# EAGLE design heater-board (EAGLE 5.04)
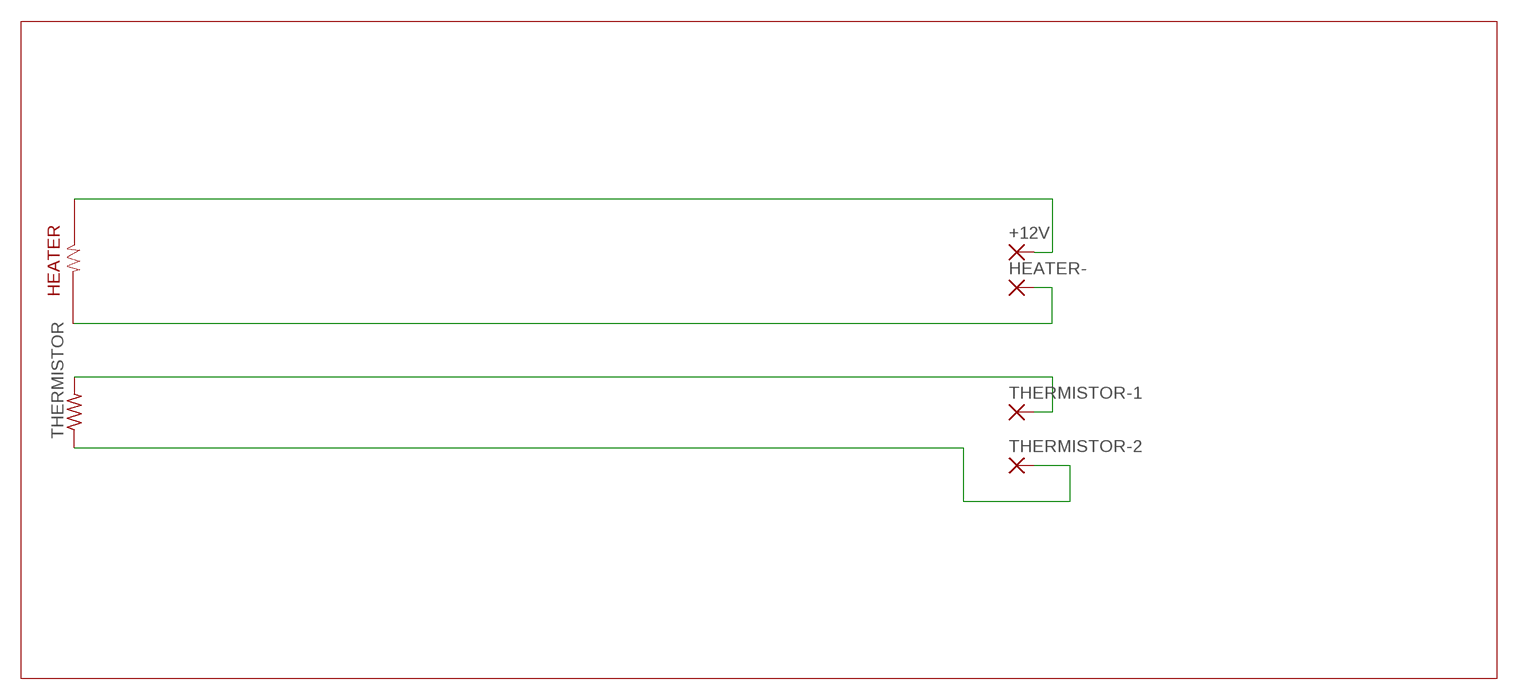
[diagram p0: schematic, sheet 1]

## Parts
+12V  WIREPADSMD5-1,8  [5-1,8]
HEATER-  WIREPADSMD5-1,8  [5-1,8]
THERMISTOR  R-US_R0805  [R0805]
THERMISTOR-1  WIREPADSMD5-1,8  [5-1,8]
THERMISTOR-2  WIREPADSMD5-1,8  [5-1,8]

## Nets
N$1: HEATER-.1(P)
N$2: THERMISTOR-1.1(P) THERMISTOR.2
N$3: THERMISTOR-2.1(P) THERMISTOR.1
N$37: +12V.1(P)

## Notes on the sheet
- HEATER

## Library data of the parts
+12V HEATER- THERMISTOR-1 THERMISTOR-2 = wirepad:WIREPAD: Wire PAD connect wire on PCB
THERMISTOR = rcl:R-US_: RESISTOR, American symbol

## Board
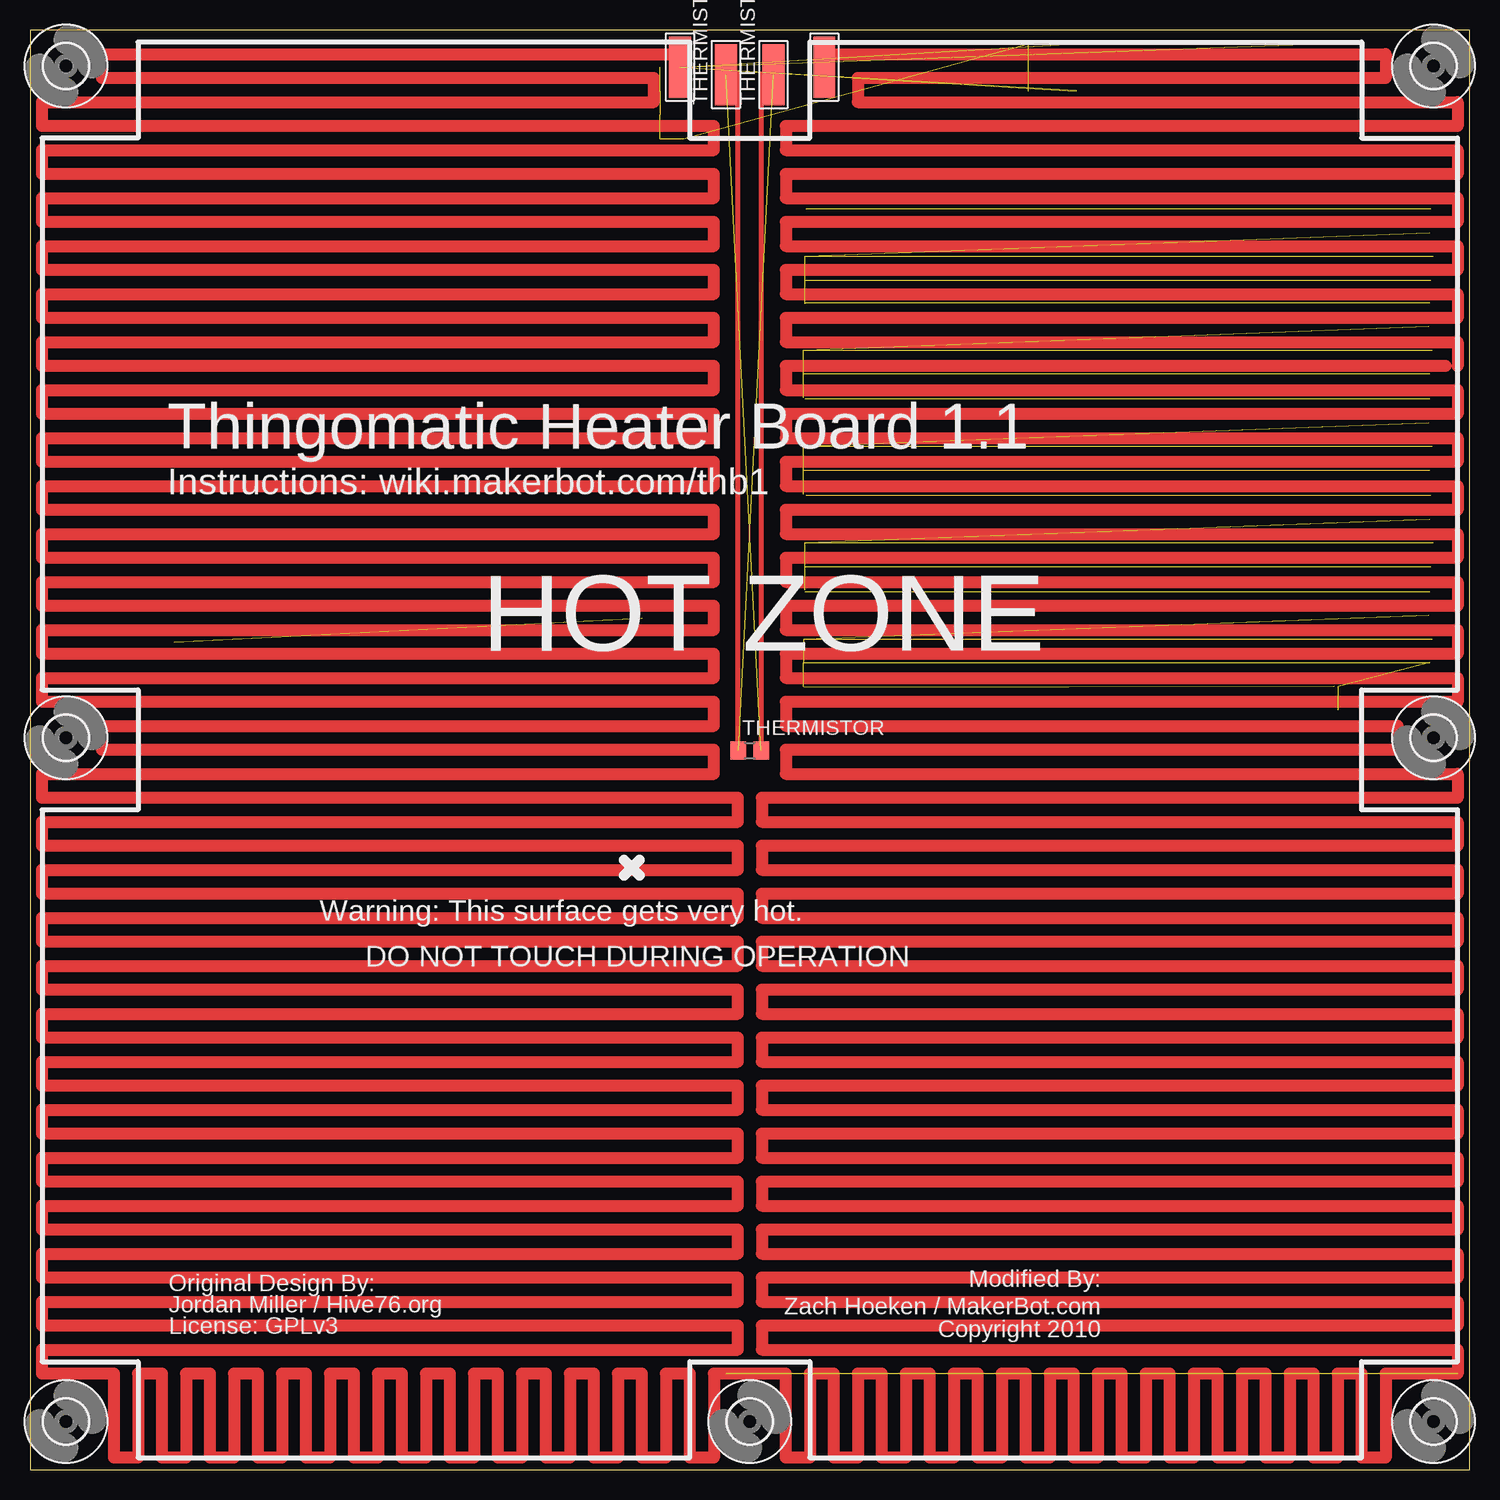
[diagram p1: board, top side]
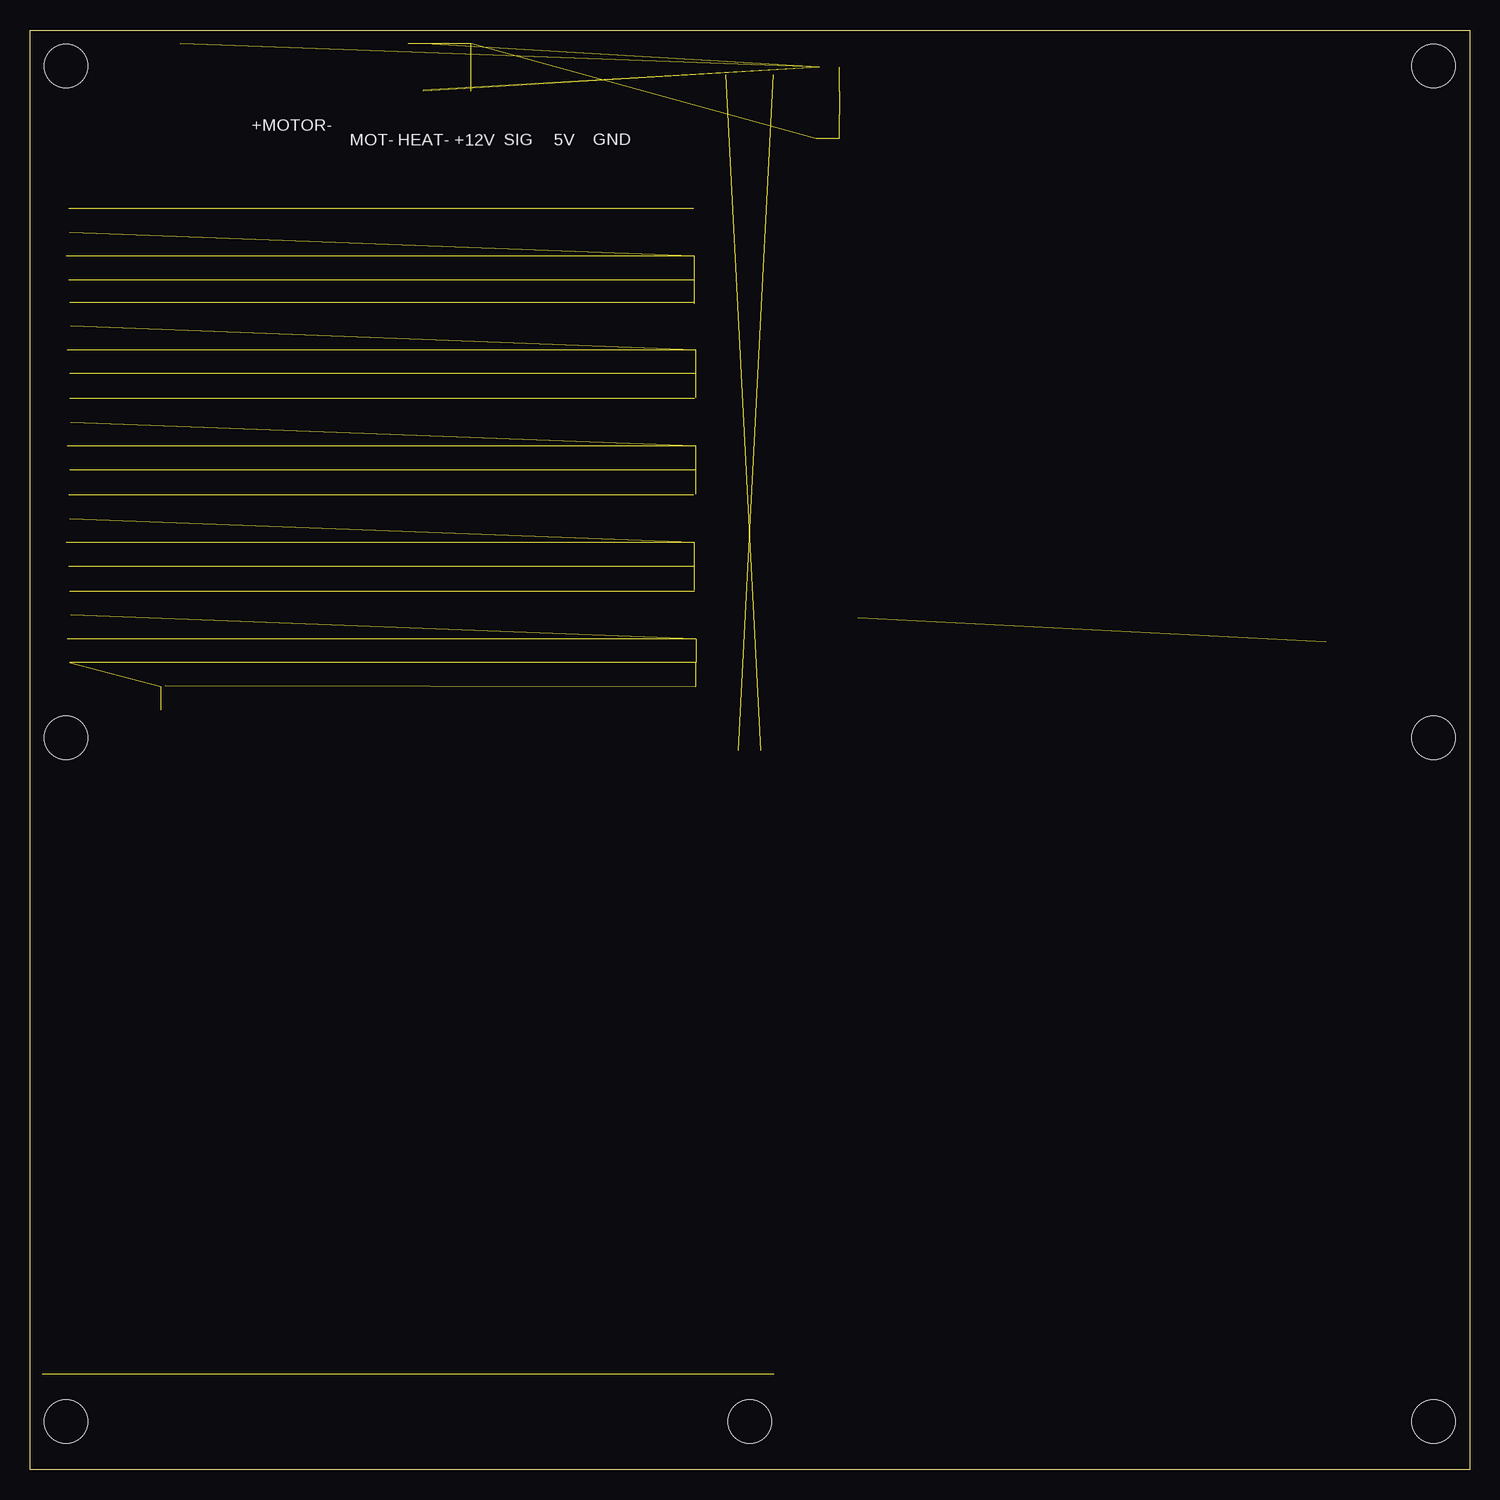
[diagram p2: board, bottom side, seen from below]

Size 120 x 120 mm. Coordinates in mm from the lower left corner, seen from the top.
Outline: 0,0 120,0 120,120 0,120 0,0
Copper layers (1*16): Top 0.035mm / dielectric 1.5mm / Bottom 0.035mm
Design rules "SparkFun *": minimum track width 10mil, minimum drill 20mil, track to track 10mil, track to pad 10mil, pad to pad 10mil, via to via 10mil, smd to smd 10mil, copper to edge 10mil, drill to drill 8mil, minimum pad ring 12mil, minimum via ring 10mil, stop-mask expansion 4mil, vias tented up to drill 25mil, thermal gap 10mil

### Footprints (pad centres in the part's own frame; a part is rotated, then mirrored left to right if it is on the bottom)
5-1,8 = smd 1.829 x 5.08: 1 0,0
R0805 = smd 1.3 x 1.5: 1 -0.95,0; 2 0.95,0
3,6 = hole 3.6: 0,0

### Placement (x,y rotation side)
+12V  66.21,116.91 180 top
HEATER-  54.17,116.91 180 top
THERMISTOR  59.99,59.94 0 top
THERMISTOR-1  58.01,116.28 0 top
THERMISTOR-2  61.98,116.28 0 top
U$2  [3,6]  3,4 0 top
U$3  [3,6]  3,61 0 top
U$4  [3,6]  3,117 0 top
U$5  [3,6]  117,117 0 top
U$6  [3,6]  117,61 0 top
U$7  [3,6]  117,4 0 top
U$8  [3,6]  60,4 0 top

### Tracks (layer width: path | path; a pad name or v marks a point on that pad's centre or on a via)
N$1  (13 unrouted)
N$2  (1 unrouted)
N$3  (1 unrouted)
N$6  (7 unrouted)
N$7  (1 unrouted)
N$10  (5 unrouted)
N$11  (1 unrouted)
N$12  (5 unrouted)
N$13  (1 unrouted)
N$14  (5 unrouted)
N$15  (1 unrouted)
N$16  (5 unrouted)
N$17  (1 unrouted)
N$18  (1 unrouted)
N$19
  Top 0.406: 60.96,59.94 60.98,59.94 60.98,116.33
N$20
  Top 0.406: 59.03,59.94 59.01,59.94 59.01,116.33
N$21  (1 unrouted)
N$22
  Top 0.991: 66,116 66,118 113,118 113,116 69,116 69,114 119,114 119,112 63,112 63,110 119,110 119,108 63,108 63,106 119,106 119,104 63,104 63,102 119,102 119,100 63,100 63,98 119,98 119,96 63,96 63,94 119,94 119,92
N$23  (1 unrouted)
  Top 0.991: 118,92 63,92 63,90 119,90 119,88 63,88 63,86 119,86 119,84 63,84 63,82 119,82 119,80 63,80 63,78 119,78 119,76 63,76 63,74 119,74 119,72 63,72 63,70 119,70 119,68 63,68 63,66 119,66 119,64 63,64 63,62 114,62 114,60 63,60 63,58 119,58 119,56 61,56 61,54 119,54 119,52 61,52 61,50 119,50 119,48 61,48 61,46 119,46 119,44 61,44 61,42 119,42 119,40 61,40 61,38 119,38 119,36 61,36 61,34 119,34 119,32 61,32 61,30 119,30 119,28 61,28 61,26 119,26 119,24 61,24 61,22 119,22 119,20 61,20 61,18 119,18 119,16 61,16 61,14 119,14 119,12 61,12 61,10 119,10 119,8 113,8 113,1 111,1 111,8 109,8 109,1 107,1 107,8 105,8 105,1 103,1 103,8 101,8 101,1 99,1 99,8 97,8 97,1 95,1 95,8 93,8 93,1 91,1 91,8 89,8 89,1 87,1 87,8 85,8 85,1 83,1 83,8 81,8 81,1 79,1 79,8 77,8 77,1 75,1 75,8 73,8 73,1 71,1 71,8 69,8 69,1 67,1 67,8 65,8 65,1 63,1 63,8 58,8 57,8 57,1 55,1 55,8 53,8 53,1 51,1 51,8 49,8 49,1 47,1 47,8 45,8 45,1 43,1 43,8 41,8 41,1 39,1 39,8 37,8 37,1 35,1 35,8 33,8 33,1 31,1 31,8 29,8 29,1 27,1 27,8 25,8 25,1 23,1 23,8 21,8 21,1 19,1 19,8 17,8 17,1 15,1 15,8 13,8 13,1 11,1 11,8 9,8 9,1 7,1 7,8 1,8 1,10 59,10 59,12 1,12 1,14 59,14 59,16 1,16 1,18 59,18 59,20 1,20 1,22 59,22 59,24 1,24 1,26 59,26 59,28 1,28 1,30 59,30 59,32 1,32 1,34 59,34 59,36 1,36 1,38 59,38 59,40 1,40 1,42 59,42 59,44 1,44 1,46 59,46 59,48 1,48 1,50 59,50 59,52 1,52 1,54 59,54 59,56 1,56 1,58 57,58 57,60 6,60 6,62 57,62 57,64 1,64 1,66 57,66 57,68 1,68 1,70 57,70 57,72 1,72 1,74 57,74 57,76 1,76 1,78 57,78 57,80 1,80 1,82 57,82 57,84 1,84 1,86 57,86 57,88 1,88 1,90 57,90 57,92 1,92 1,94 57,94 57,96 1,96 1,98 57,98 57,100 1,100 1,102 57,102 57,104 1,104 1,106 57,106 57,108 1,108 1,110 57,110 57,112 1,112 1,114 52,114 52,116 6,116 6,118 54,118

### Text on the board
tPlace: Thingomatic Heater Board 1.1 | Instructions: wiki.makerbot.com/thb1 | HOT ZONE | Warning: This surface gets very hot. | DO NOT TOUCH DURING OPERATION | Modified By: | Original Design By: | Zach Hoeken / MakerBot.com | Jordan Miller / Hive76.org | Copyright 2010 | License: GPLv3
bPlace: +MOTOR- | GND | 5V | SIG | +12V | HEAT- | MOT-